# EAGLE design power_v2 (EAGLE 9.2.2)
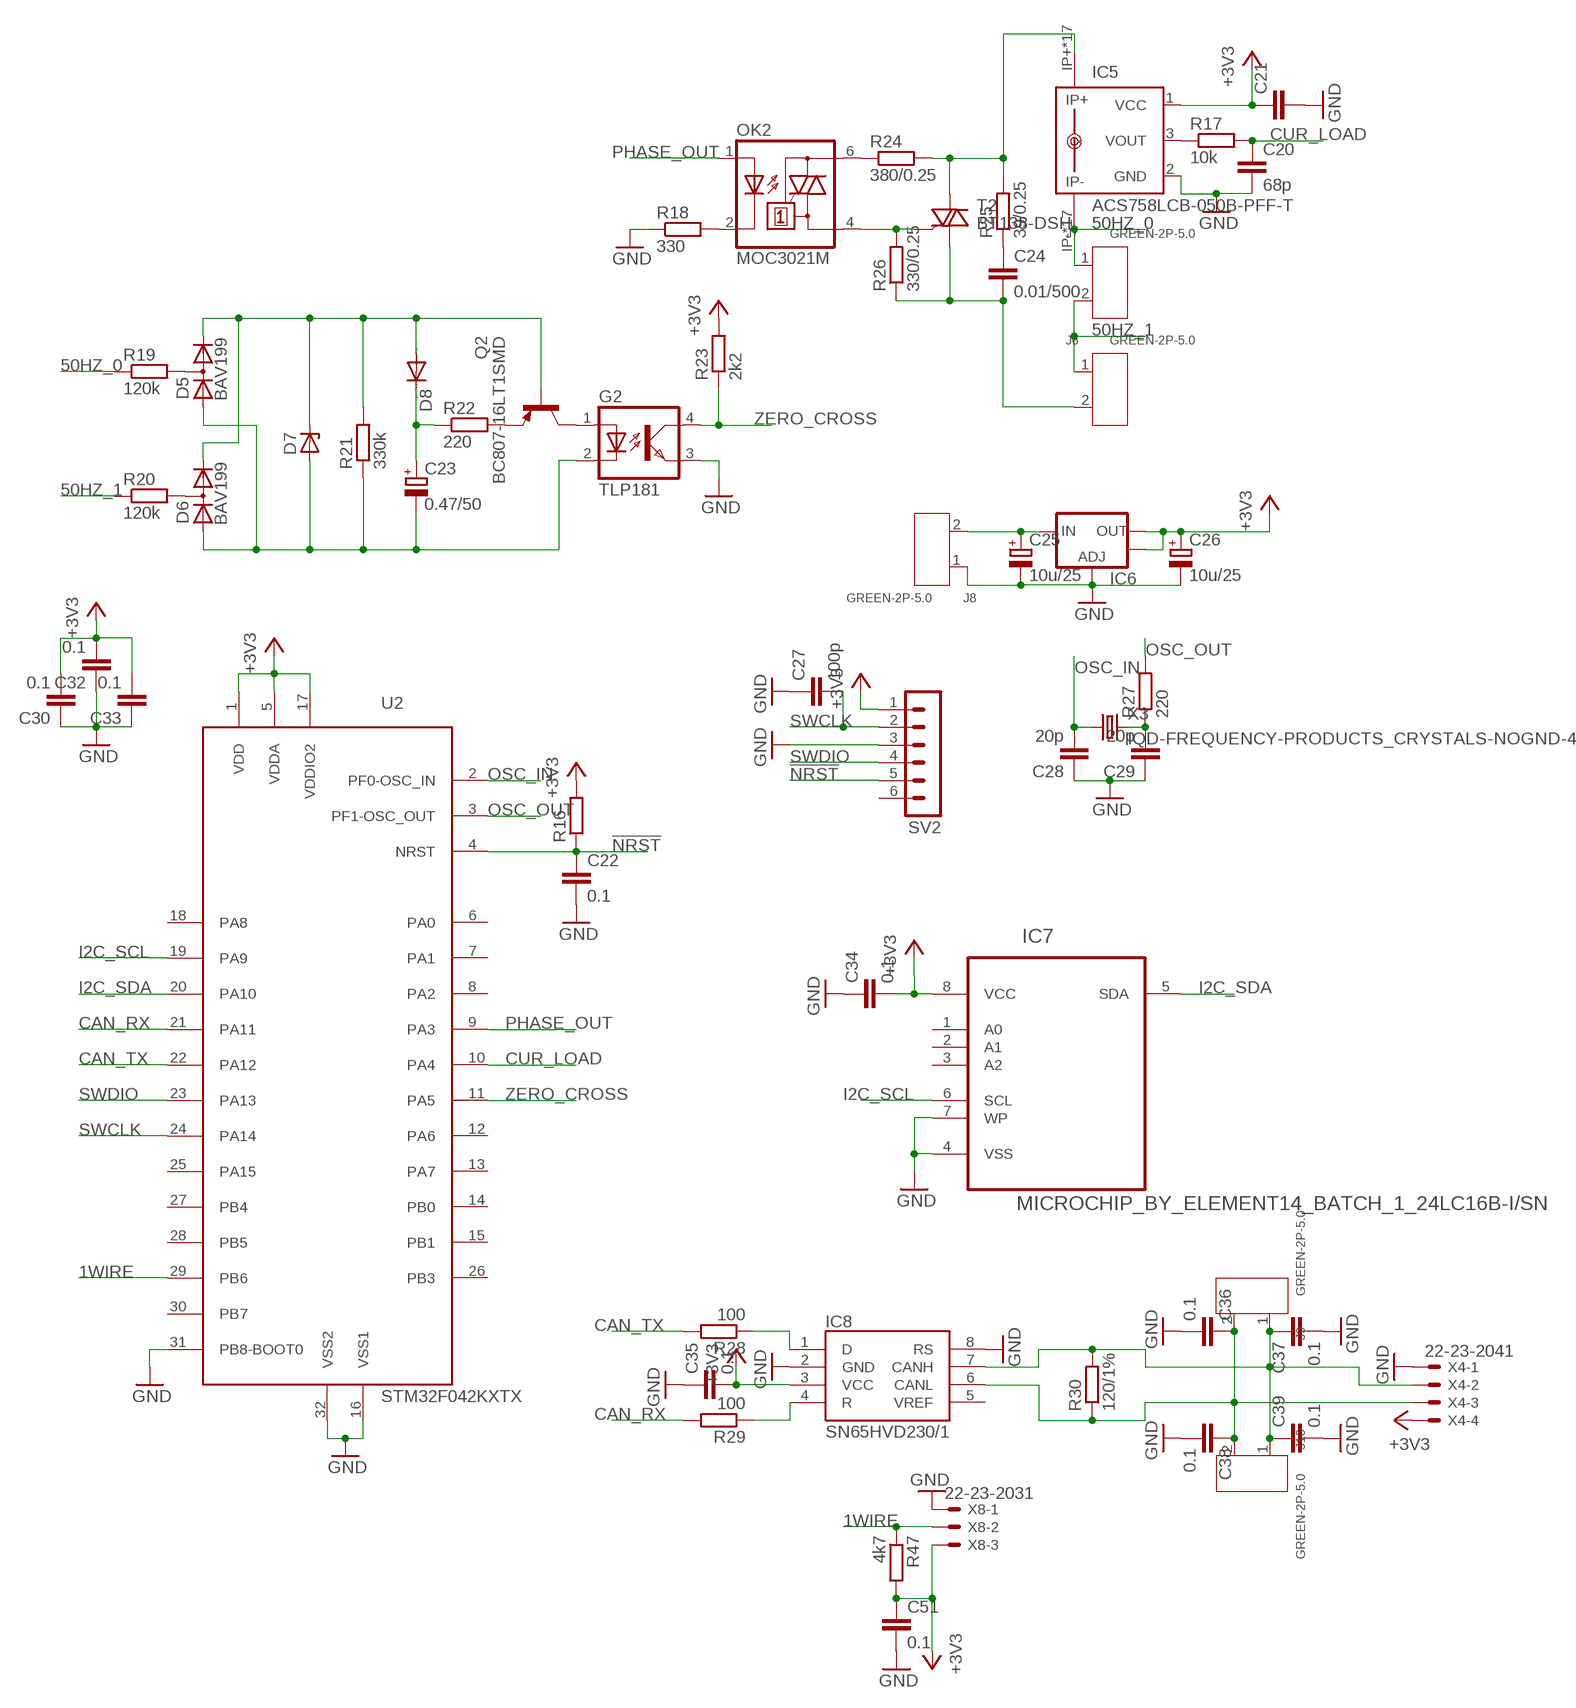
[diagram p0: schematic, sheet 1]

## Parts
C20  68p  C-EUC0603  [C0603]
C21  C-EUC0603  [C0603]
C22  0.1  C-EUC0603  [C0603]
C23  0.47/50  CPOL-EUC/6032-28R  [C/6032-28R]
C24  0.01/500  C-EUC1206  [C1206]
C25  10u/25  CPOL-EUSMCB  [SMC_B]
C26  10u/25  CPOL-EUSMCB  [SMC_B]
C27  100p  C-EUC0603  [C0603]
C28  20p  C-EUC0603  [C0603]
C29  20p  C-EUC0603  [C0603]
C30  0.1  C-EUC0603  [C0603]
C32  0.1  C-EUC0603  [C0603]
C33  0.1  C-EUC0603  [C0603]
C34  0.1  C-EUC0603  [C0603]
C35  0.1  C-EUC0603  [C0603]
C36  0.1  C-EUC0603  [C0603]
C37  0.1  C-EUC0603  [C0603]
C38  0.1  C-EUC0603  [C0603]
C39  0.1  C-EUC0603  [C0603]
C51  0.1  C-EUC0603  [C0603]
D5  BAV199  [SOT23]
D6  BAV199  [SOT23]
D7  ZENER-DIODESOD80C  [SOD80C]
D8  DIODE-SOD523  [SOD523]
G2  TLP181  [SOP04]
IC5  ACS758LCB-050B-PFF-T  [CB-PFF]
IC6  V_REG_LM1117SOT223  [SOT223]
IC7  MICROCHIP_BY_ELEMENT14_BATCH_1_24LC16B-I/SN  [MICROCHIP_BY_ELEMENT14_BATCH_1_SOIC127P600X175-8N]
IC8  SN65HVD230/1  [SO8]
J6  GREEN-2P-5.0  SCREW-TERMINAL-GREEN(2P-5.0)  [H2-5.0-10.5X8.0MM]
J7  GREEN-2P-5.0  SCREW-TERMINAL-GREEN(2P-5.0)  [H2-5.0-10.5X8.0MM]
J8  GREEN-2P-5.0  SCREW-TERMINAL-GREEN(2P-5.0)  [H2-5.0-10.5X8.0MM]
J9  GREEN-2P-5.0  SCREW-TERMINAL-GREEN(2P-5.0)  [H2-5.0-10.5X8.0MM]
J10  GREEN-2P-5.0  SCREW-TERMINAL-GREEN(2P-5.0)  [H2-5.0-10.5X8.0MM]
OK2  MOC3021M  [DIL06]
Q2  BC807-16LT1SMD  [SOT23-BEC]
R16  R-EU_R0603  [R0603]
R17  10k  R-EU_R0603  [R0603]
R18  330  R-EU_R0603  [R0603]
R19  120k  R-EU_R1206  [R1206]
R20  120k  R-EU_R1206  [R1206]
R21  330k  R-EU_R1206  [R1206]
R22  220  R-EU_R1206  [R1206]
R23  2k2  R-EU_R0603  [R0603]
R24  380/0.25  R-EU_M1206  [M1206]
R25  39/0.25  R-EU_M1206  [M1206]
R26  330/0.25  R-EU_M1206  [M1206]
R27  220  R-EU_R0603  [R0603]
R28  100  R-EU_R0603  [R0603]
R29  100  R-EU_R0603  [R0603]
R30  120/1%  R-EU_R0603  [R0603]
R47  4k7  R-EU_R0603  [R0603]
SV2  CON-LSTB_MA06-1  [CON-LSTB_MA06-1]
T2  BT138-DSH  [TO220DSH]
U2  STM32F042KXTX  [LQFP32]
X3  IQD-FREQUENCY-PRODUCTS_CRYSTALS-NOGND-4-HSMX  [IQD-FREQUENCY-PRODUCTS_HC49-4-HSMX]
X4  22-23-2041  [22-23-2041]
X8  22-23-2031  [22-23-2031]

## Nets
1WIRE: R47.1 U2.29(PB6) X8.2
50HZ_0: IC5.IP- IC5.IP-@2(IP-) IC5.IP-@3(IP-) IC5.IP-@4(IP-) IC5.IP-@5(IP-) IC5.IP-@6(IP-) IC5.IP-@7(IP-) IC5.IP-@8(IP-) IC5.IP-@9(IP-) IC5.IP-@10(IP-) IC5.IP-@11(IP-) IC5.IP-@12(IP-) IC5.IP-@13(IP-) IC5.IP-@14(IP-) IC5.IP-@15(IP-) IC5.IP-@16(IP-) IC5.IP-@17(IP-) J7.1 R19.1
50HZ_1: J6.1 J7.2 R20.1
!NRST: C22.1 R16.1 SV2.5 U2.4(NRST)
+3V3: C21.1 C26.+ C30.2 C32.2 C33.2 C34.2 C35.2 C51.1 IC5.1(VCC) IC6.2(OUT) IC6.4(OUT) IC7.8(VCC) IC8.3(VCC) R16.2 R23.2 R47.2 SV2.1 U2.1(VDD) U2.5(VDDA) U2.17(VDDIO2) X4.4 X8.3
CAN_RX: R29.2 U2.21(PA11)
CAN_TX: R28.2 U2.22(PA12)
CUR_LOAD: C20.1 R17.2 U2.10(PA4)
GND: C20.2 C21.2 C22.2 C25.- C26.- C27.1 C28.1 C29.1 C30.1 C32.1 C33.1 C34.1 C35.1 C36.2 C37.2 C38.2 C39.2 C51.2 G2.3(EMIT) IC5.2(GND) IC6.1(ADJ) IC7.4(VSS) IC7.7(WP) IC8.2(GND) IC8.8(RS) J8.1 R18.1 SV2.3 U2.16(VSS1) U2.31(PB8-BOOT0) U2.32(VSS2) X4.1 X8.1
I2C_SCL: IC7.6(SCL) U2.19(PA9)
I2C_SDA: IC7.5(SDA) U2.20(PA10)
N$12: IC5.3(VOUT) R17.1
N$15: D5.3(AC) R19.2
N$19: D6.3(AC) R20.2
N$23: D5.2(C) D6.2(C) D7.C D8.A Q2.B R21.2
N$25: C23.- D5.1(A) D6.1(A) D7.A G2.2(C) R21.1
N$26: C23.+ D8.C R22.1
N$27: Q2.E R22.2
N$28: G2.1(A) Q2.C
N$29: OK2.6(A2) R24.1
N$30: C24.1 R25.1
N$31: OK2.4(A1) R26.2 T2.G
N$32: IC5.IP+ IC5.IP+@2(IP+) IC5.IP+@3(IP+) IC5.IP+@4(IP+) IC5.IP+@5(IP+) IC5.IP+@6(IP+) IC5.IP+@7(IP+) IC5.IP+@8(IP+) IC5.IP+@9(IP+) IC5.IP+@10(IP+) IC5.IP+@11(IP+) IC5.IP+@12(IP+) IC5.IP+@13(IP+) IC5.IP+@14(IP+) IC5.IP+@15(IP+) IC5.IP+@16(IP+) IC5.IP+@17(IP+) R24.2 R25.2 T2.A2
N$33: C24.2 J6.2 R26.1 T2.A1
N$34: C25.+ IC6.3(IN) J8.2
N$35: C29.2 R27.1 X3.2
N$36: C36.1 C38.1 IC8.6(CANL) J9.2 J10.2 R30.1 X4.3
N$37: IC8.1(D) R28.1
N$38: IC8.4(R) R29.1
N$39: C37.1 C39.1 IC8.7(CANH) J9.1 J10.1 R30.2 X4.2
N$40: OK2.2(C) R18.2
OSC_IN: C28.2 U2.2(PF0-OSC_IN) X3.1
OSC_OUT: R27.2 U2.3(PF1-OSC_OUT)
PHASE_OUT: OK2.1(A) U2.9(PA3)
SWCLK: C27.2 SV2.2 U2.24(PA14)
SWDIO: SV2.4 U2.23(PA13)
ZERO_CROSS: G2.4(COL) R23.1 U2.11(PA5)
Unconnected: IC7.1(A0) IC7.2(A1) IC7.3(A2) IC8.5(VREF) SV2.6 U2.6(PA0) U2.7(PA1) U2.8(PA2) U2.12(PA6) U2.13(PA7) U2.14(PB0) U2.15(PB1) U2.18(PA8) U2.25(PA15) U2.26(PB3) U2.27(PB4) U2.28(PB5) U2.30(PB7)

## Library data of the parts
C20 C30 = rcl:C-EU: CAPACITOR, European symbol; SPICEPREFIX: C
C21 C22 C24 C27-C29 C32-C39 C51 = rcl:C-EU: CAPACITOR, European symbol
C23 C25 C26 = rcl:CPOL-EU: POLARIZED CAPACITOR, European symbol
D5 D6 = diode:BAV199: DIODE low-leakage double diode
D7 = diode:ZENER-DIODE: Z-Diode
D8 = diode:DIODE-: DIODE
G2 = distillery:TLP181
IC5 = allegro:ACS758*: Thermally Enhanced, Fully Integrated, Hall Effect-Based Linear Current Sensor with 100 micro Ohm Current Conductor display layer 49 Reference in BRD and place VIAs on circles Source: http://www.allegromicro.com/en/Products/Part_Numbers/0758/0758.pdf; MPN: ACS758LCB-050B-PFF-T; OC_FARNELL: 1718997; OC_NEWARK: 04R7131
IC6 = SparkFun:V_REG_LM1117: Voltage Regulator LM1117 Standard adjustable voltage regulator but in SMD form. Spark Fun Electronics SKU : COM-00595
IC7 = distillery:MICROCHIP_BY_ELEMENT14_BATCH_1_24LC16B-I/SN: 16K I2C Serial EEPROM; MPN: 24LC16B-I/SN; OC_FARNELL: 1296575; OC_NEWARK: 69K7670; PACKAGE: SOIC-8; SUPPLIER: MICROCHIP
IC8 = distillery:SN65HVD230/1
J6-J10 = distillery:SCREW-TERMINAL-GREEN(2P-5.0): 320110031
OK2 = optocoupler:MOC30*M: RANDOM-PHASE OPTOISOLATORS TRIAC DRIVER OUTPUT Source: http://www.fairchildsemi.com MOC3020-M.pdf; MF: FAIRCHILD SEMICONDUCTOR; MPN: MOC3021-M; OC_FARNELL: 1021365; OC_NEWARK: 95B7895
Q2 = transistor-pnp:BC807*: PNP Transistror
R16 R17 R19-R27 R29 R30 = rcl:R-EU_: RESISTOR, European symbol
R18 R28 R47 = rcl:R-EU_: RESISTOR, European symbol; SPICEPREFIX: R
SV2 = distillery:CON-LSTB_MA06-1: PIN HEADER; OC_FARNELL: unknown; OC_NEWARK: unknown
T2 = distillery:BT138: TRIAC Source: http://www.semiconductors.philips.com BT138_SERIES_2.pdf
U2 = stm32f0:STM32F042KXTX
X3 = distillery:IQD-FREQUENCY-PRODUCTS_CRYSTALS-NOGND: CRYSTALS CAN NOT GROUNDED
X4 = con-molex:22-23-2041: .100" (2.54mm) Center Header - 4 Pin; MF: MOLEX; MPN: 22-23-2041; OC_FARNELL: 1462920; OC_NEWARK: 38C0355
X8 = con-molex:22-23-2031: .100" (2.54mm) Center Header - 3 Pin; MF: MOLEX; MPN: 22-23-2031; OC_FARNELL: 1462950; OC_NEWARK: 30C0862

## Board
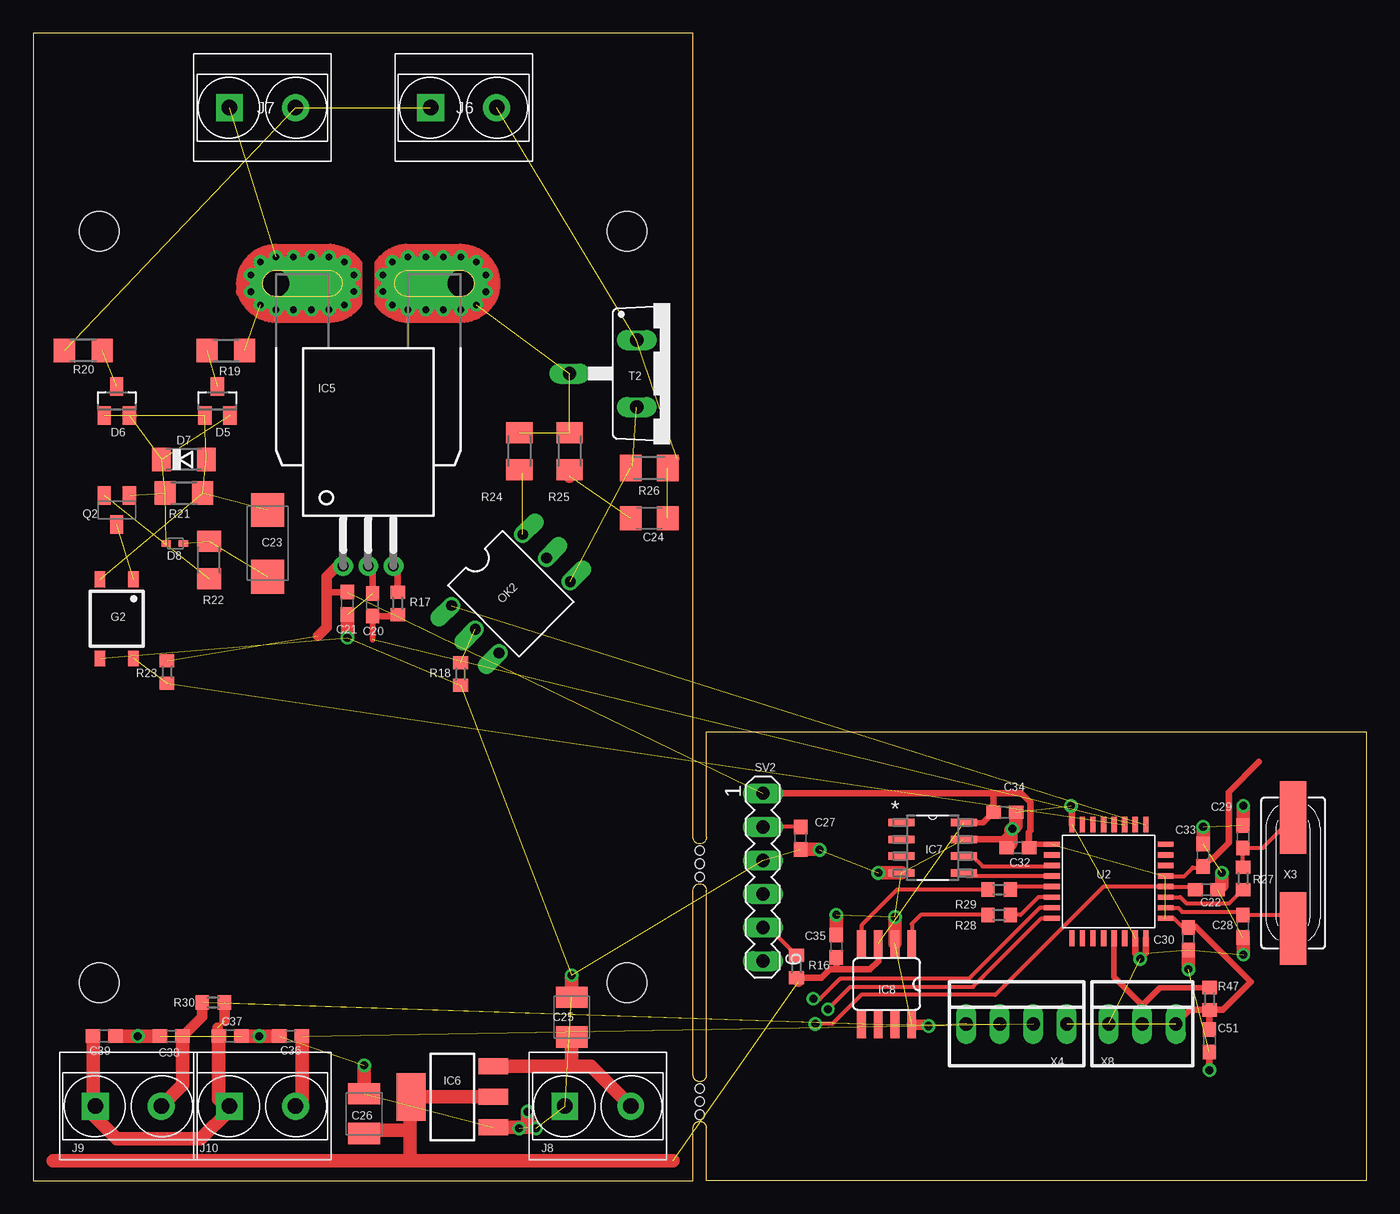
[diagram p1: board, top side]
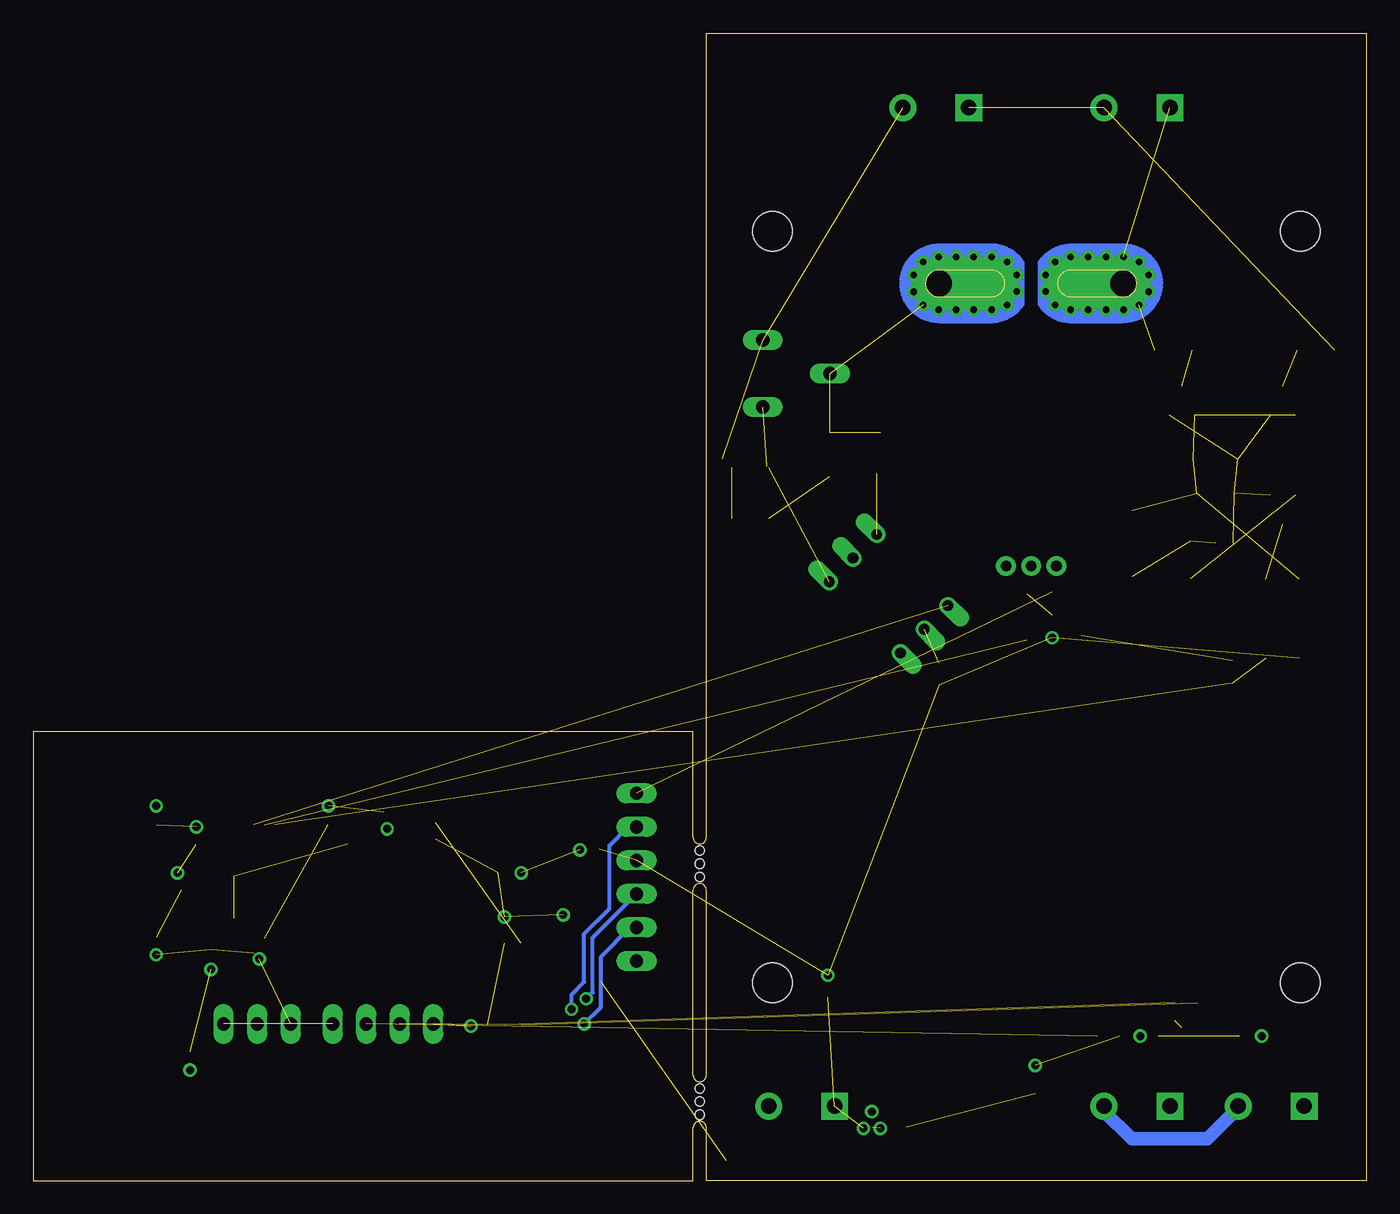
[diagram p2: board, bottom side, seen from below]

Size 101 x 86.9 mm. Coordinates in mm from the lower left corner, seen from the top.
Outline: 0,0 50,0 50,4 arc-180 51,4 51,0 101,0 101,34 51,34 51,26 arc-180 50,26 50,86.9 0,86.9 0,0
Outline: 50,8 50,22 arc-180 51,22 51,8 arc-180 50,8
Copper layers (1*16): Top 0.035mm / dielectric 1.5mm / Bottom 0.035mm
Design rules "default": minimum track width 10mil, minimum drill 16mil, track to track 12mil, track to pad 12mil, pad to pad 12mil, via to via 12mil, smd to smd 8mil, copper to edge 40mil, drill to drill 10mil, minimum pad ring 10mil, minimum via ring 8mil, stop-mask expansion 4mil, vias tented up to drill 0.7mm, thermal gap 10mil
Holes 3 mm at 5,15 45,15 5,71.9 45,71.9
Holes 0.7 mm at 50.5,5 50.5,6 50.5,23 50.5,24 50.5,25 50.5,7

### Footprints (pad centres in the part's own frame; a part is rotated, then mirrored left to right if it is on the bottom)
C0603 = smd 1.1 x 1: 1 -0.85,0; 2 0.85,0
C/6032-28R = smd 2.55 x 2.5: + 2.525,0; - -2.525,0
C1206 = smd 1.6 x 1.8: 1 -1.4,0; 2 1.4,0
SMC_B = smd 1.6 x 2.4: + -1.5,0; - 1.5,0
SOT23 = smd 1 x 1.4: 1 -0.95,-1.1; 2 0.95,-1.1; 3 0,1.1
SOD80C = smd 1.4 x 1.8: A 1.7,0; C -1.7,0
SOD523 = smd 0.7 x 0.5: A 0.7,0; C -0.6,0
SOP04 = smd 0.8 x 1.2: 1 -1.27,-3; 2 1.27,-3; 3 1.27,3; 4 -1.27,3
CB-PFF = drill 0.8 pad 1.5: 1 -1.91,-21.4; 2 0,-21.4; 3 1.91,-21.4 | drill 2 pad 4 offset: IP+ 7,0; IP- -7,0 | drill 0.5 pad 0.9: IP+@2 8.89,0.635; IP+@3 8.89,-0.635; IP+@4 8.175,-1.625; IP+@5 7,-2; IP+@6 5.675,-2; IP+@7 4.35,-2; IP+@8 3,-2; IP+@9 1.825,-1.625; IP+@10 1.1,-0.625; IP+@11 1.1,0.625; IP+@12 1.825,1.625; IP+@13 3,2; IP+@14 4.35,2; IP+@15 5.675,2; IP+@16 7,2; IP+@17 8.175,1.625; IP-@2 -8.89,0.635; IP-@3 -8.89,-0.635; IP-@4 -8.175,-1.625; IP-@5 -7,-2; IP-@6 -5.675,-2; IP-@7 -4.325,-2; IP-@8 -3,-2; IP-@9 -1.825,-1.625; IP-@10 -1.1,-0.625; IP-@11 -1.1,0.625; IP-@12 -1.825,1.625; IP-@13 -3,2; IP-@14 -4.325,2; IP-@15 -5.675,2; IP-@16 -7,2; IP-@17 -8.175,1.625
SOT223 = smd 1.219 x 2.235: 1 -2.311,-3.099; 2 0,-3.099; 3 2.311,-3.099 | smd 3.6 x 2.2: 4 0,3.099
MICROCHIP_BY_ELEMENT14_BATCH_1_SOIC127P600X175-8N = smd 1.981 x 0.559: 1 -2.362,1.905; 2 -2.362,0.635; 3 -2.362,-0.635; 4 -2.362,-1.905; 5 2.362,-1.905; 6 2.362,-0.635; 7 2.362,0.635; 8 2.362,1.905
SO8 = smd 0.66 x 2.032: 1 -1.905,-3.073; 2 -0.635,-3.073; 3 0.635,-3.073; 4 1.905,-3.073; 5 1.905,3.073; 6 0.635,3.073; 7 -0.635,3.073; 8 -1.905,3.073
H2-5.0-10.5X8.0MM = drill 1.168 pad 2.032 square: 1 0,-0.04 | drill 1.168 pad 2.032: 2 0,-5.04
DIL06 = drill 0.813 offset: 1 -2.54,-3.81; 2 0,-3.81; 3 2.54,-3.81; 4 2.54,3.81; 5 0,3.81; 6 -2.54,3.81
SOT23-BEC = smd 1 x 1.4: B -0.95,-1.1; C 0,1.1; E 0.95,-1.1
R0603 = smd 1 x 1.1: 1 -0.85,0; 2 0.85,0
R1206 = smd 1.6 x 1.803: 1 -1.422,0; 2 1.422,0
M1206 = smd 1.6 x 2: 1 -1.4,0; 2 1.4,0
CON-LSTB_MA06-1 = drill 1.016 long: 1 -6.35,0; 2 -3.81,0; 3 -1.27,0; 4 1.27,0; 5 3.81,0; 6 6.35,0
TO220DSH = drill 1.016 long: A1 -2.54,-2.54; A2 0,-7.62; G 2.54,-2.54
LQFP32 = smd 0.4 x 1.2: 1 -2.8,-4.3; 2 -2,-4.3; 3 -1.2,-4.3; 4 -0.4,-4.3; 5 0.4,-4.3; 6 1.2,-4.3; 7 2,-4.3; 8 2.8,-4.3; 17 2.8,4.3; 18 2,4.3; 19 1.2,4.3; 20 0.4,4.3; 21 -0.4,4.3; 22 -1.2,4.3; 23 -2,4.3; 24 -2.8,4.3 | smd 1.2 x 0.4: 9 4.3,-2.8; 10 4.3,-2; 11 4.3,-1.2; 12 4.3,-0.4; 13 4.3,0.4; 14 4.3,1.2; 15 4.3,2; 16 4.3,2.8; 25 -4.3,2.8; 26 -4.3,2; 27 -4.3,1.2; 28 -4.3,0.4; 29 -4.3,-0.4; 30 -4.3,-1.2; 31 -4.3,-2; 32 -4.3,-2.8
IQD-FREQUENCY-PRODUCTS_HC49-4-HSMX = smd 5.5 x 2: 1 -4.2,0; 2 4.2,0
22-23-2041 = drill 1 long: 1 -3.81,0; 2 -1.27,0; 3 1.27,0; 4 3.81,0
22-23-2031 = drill 1 long: 1 -2.54,0; 2 0,0; 3 2.54,0

### Placement (x,y rotation side)
C20  25.72,43.6 90 top
C21  23.81,43.71 270 top
C22  88.89,22.04 0 top
C23  17.78,48.26 270 top
C24  46.67,50.16 0 top
C25  40.8,12.38 90 top
C26  25.08,5.08 90 top
C27  58.14,25.95 90 top
C28  91.64,19.28 90 top
C29  91.64,26.06 270 top
C30  87.51,18.33 90 top
C32  74.6,25.21 0 top
C33  88.62,24.63 270 top
C34  73.6,27.91 180 top
C35  60.84,17.75 270 top
C36  19.53,10.95 180 top
C37  14.92,10.95 0 top
C38  10.48,10.95 180 top
C39  5.4,10.95 0 top
C51  89.1,10.61 270 top
D5  13.97,59.05 0 top
D6  6.35,59.05 0 top
D7  11.43,54.61 0 top
D8  10.79,48.26 180 top
G2  6.35,42.55 180 top
IC5  25.4,67.94 0 top
IC6  31.75,6.35 90 top
IC7  68.14,25.21 0 top
IC8  64.65,14.89 180 top
J6  30.08,81.25 90 top
J7  14.84,81.25 90 top
J8  40.24,5.65 90 top
J9  4.68,5.65 90 top
J10  14.84,5.65 90 top
OK2  36.2,44.45 315 top
Q2  6.35,50.8 180 top
R16  57.83,16.22 270 top
R17  27.62,43.71 270 top
R18  32.38,38.36 90 top
R19  14.61,62.87 180 top
R20  3.81,62.87 0 top
R21  11.43,52.07 180 top
R22  13.34,46.99 270 top
R23  10.16,38.52 90 top
R24  36.83,55.24 90 top
R25  40.64,55.24 90 top
R26  46.67,53.98 180 top
R27  91.64,22.89 270 top
R28  73.17,20.13 0 top
R29  73.17,22.04 0 top
R30  13.65,13.49 0 top
R47  89.1,13.78 270 top
SV2  55.29,22.99 270 top
T2  48.26,61.12 270 top
U2  81.48,22.67 90 top
X3  95.45,23.3 90 top
X4  74.5,11.88 0 top
X8  84.02,11.88 0 top

### Tracks (layer width: path | path; a pad name or v marks a point on that pad's centre or on a via)
1WIRE
  Top 0.406: 84.02,13.3 X8.2 | U2.29 81.88,15.44 84.02,13.3 | R47.1 85.35,14.63 84.02,13.3
50HZ_0  (2 unrouted)
  Top 1.016: 16.03,67.16 15.88,67.31 16.51,67.94 IC5.IP-
50HZ_1  (2 unrouted)
!NRST  (via drill 0.61)
  Top 0.305: C22.1 87.8,22.27 U2.4 81.08,22.27 72.88,14.07 62.75,14.07 60.55,11.88 v59.26,11.88 | SV2.5 55.72,19.18 R16.1
  Bottom 0.305: v59.26,11.88 57.98,13.14 57.98,16.95 55.76,19.18 SV2.5
+3V3  (7 unrouted)
  Top 0.305: C30.2 87.45,19.23 87.05,19.23 86.42,19.87 U2.1 | U2.5 87.21,23.07 87.84,23.7 88.55,23.7 C33.2
  Top 0.406: U2.17 75.71,25.47 C32.2 | IC7.8 71.95,27.11 C34.2
  Top 0.508: IC8.3 64.02,16.64 63.38,16 60.84,16 | 60.84,16 60.37,16 59.73,15.37 R16.2 | C35.2 60.84,16 | C33.2 89.22,24.37 89.36,24.37 90.57,25.59 90.57,29.43 92.86,31.72 | C32.2 75.45,26.38 75.56,26.49 75.56,28.64 74.86,29.34 72.59,29.34 | SV2.1 72.59,29.34 | C34.2 72.75,29.18 72.59,29.34 | C30.2 87.56,19.22 88.06,19.22 92.23,15.05 90.11,12.93 R47.2 | C21.1 22.34,44.56 22.23,44.45 | R47.2 87.61,12.93 X8.3 | C51.1 R47.2
  Top 0.813: 21.59,41.27 22.23,41.91 22.23,44.45 22.23,45.72 23.05,46.55 IC5.1 | 57.98,15.05 57.83,15.21 R16.2
  Top 1.016: 1.52,1.52 28.57,1.52 | 28.57,1.52 48.48,1.52 | IC6.2 IC6.4 28.57,6.27 28.57,3.81 | 28.57,3.81 28.57,1.52 | C26.+ 25.31,3.81 28.57,3.81
CAN_RX
  Top 0.305: U2.21 74.25,22.27 R29.2
CAN_TX
  Top 0.305: U2.22 76.15,21.47 74.81,20.13 R28.2
CUR_LOAD  (1 unrouted)
  Top 0.406: 25.72,40.96 C20.1
  Top 0.508: C20.1 27.51,42.75 R17.2
GND  (via drill 0.61)  (27 unrouted)
  Top 0.508: U2.32 84.28,17.21 v83.86,16.8 83.48,17.18 U2.31 | v78.62,28.39 78.68,28.33 U2.16 | C20.2 25.72,46.23 IC5.2 | C22.2 90.05,22.35 | IC7.7 73.41,25.84 74.08,26.52 | C51.2 v89.1,8.38
  Top 0.813: v74.18,26.64 74.08,26.55 74.08,26.52 | IC8.8 67.73,11.82 v67.83,11.72
  Top 1.016: C37.2 v17.14,10.95 C36.2 | C29.1 91.67,26.94 v91.67,28.39 | C28.1 91.67,18.4 v91.67,17.11 | C39.2 v7.94,10.95 C38.2 | C30.1 v87.51,16 | v88.62,26.8 C33.1 | 90.05,22.35 v90.05,23.3 | IC7.4 v64.02,23.3 | C32.1 74.08,25.55 74.08,26.52 74.45,26.89 C34.1 | IC8.2 v65.29,19.97 | C35.1 v60.84,20.13 | IC6.1 37.47,4.04 | 37.47,4.04 38.03,4.04 v38.1,3.97 | C26.- v25.08,8.73 | C21.2 v23.81,41.12 | v37.47,5.24 37.47,4.04 | C27.1 59.53,25.1 v59.57,25.05 | C25.- v40.8,15.56
  other vias: 36.83,3.97
I2C_SCL
  Top 0.305: U2.19 77.11,23.8 71.94,23.8 71.16,24.57 IC7.6
I2C_SDA
  Top 0.305: U2.20 70.74,23.07 IC7.5
N$12
  Top 0.508: R17.1 27.62,46.23 IC5.3
N$15  (1 unrouted)
N$19  (1 unrouted)
N$23  (5 unrouted)
N$25  (5 unrouted)
N$26  (2 unrouted)
N$27  (1 unrouted)
N$28  (1 unrouted)
N$29  (1 unrouted)
  Top 1.016: 37.09,53.58 R24.1
N$30  (1 unrouted)
  Top 1.016: 40.64,53.34 R25.1
N$31  (2 unrouted)
  Top 1.016: 45.4,54.1 R26.2
N$32  (3 unrouted)
N$33  (3 unrouted)
  Top 0.406: R26.1 48.78,54.68
N$34
  Top 1.016: IC6.3 40.01,8.66 40.8,8.66 | J8.2 42.27,8.66 41.12,8.66 40.8,8.66 | C25.+ 40.8,8.66
N$35
  Top 0.305: R27.1 C29.2 93.16,25.21 X3.2
N$36  (2 unrouted)
  Top 0.813: C38.1 12.8,12.43 R30.1
  Top 1.016: C38.1 11.33,7.26 J9.2 | J10.2 20.38,6.15 C36.1
  Bottom 1.016: J9.2 9.72,5.52 12.06,3.17 17.78,3.17 19.88,5.28 J10.2
N$37
  Top 0.305: R28.1 67.24,20.13 66.56,19.45 IC8.1
N$38
  Top 0.305: R29.1 65.44,22.04 62.75,19.34 IC8.4
N$39  (3 unrouted)
  Top 0.813: R30.2 14.5,12.12 | 13.97,11.59 13.97,11.06 C37.1
  Top 1.016: 14.88,5.36 12.7,3.17 6.35,3.17 4.72,4.8 J9.1 4.55,5.82 C39.1 | 14.88,5.36 J10.1 | C37.1 14.07,6.16 14.88,5.36
N$40  (1 unrouted)
OSC_IN
  Top 0.305: X3.1 94.42,20.13 C28.2 91.42,20.35 87.05,20.35 86.73,20.67 U2.2
OSC_OUT
  Top 0.305: R27.2 90.6,20.99 87.37,20.99 86.89,21.47 U2.3
PHASE_OUT  (1 unrouted)
SWCLK  (via drill 0.61)
  Top 0.305: C27.2 SV2.2 | U2.24 76.39,19.87 71.2,14.68 61.9,14.68 v60.21,12.99
  Bottom 0.305: SV2.2 55.92,26.8 57.35,25.37 57.35,20.61 59.26,18.7 59.26,15.05 60.21,14.1 v60.21,12.99
SWDIO  (via drill 0.61)
  Top 0.305: U2.23 76.27,20.67 70.89,15.29 61.12,15.29 59.61,13.78 v59.1,13.78
  Bottom 0.305: SV2.4 58.62,18.38 58.62,14.26 v59.1,13.78
ZERO_CROSS  (2 unrouted)